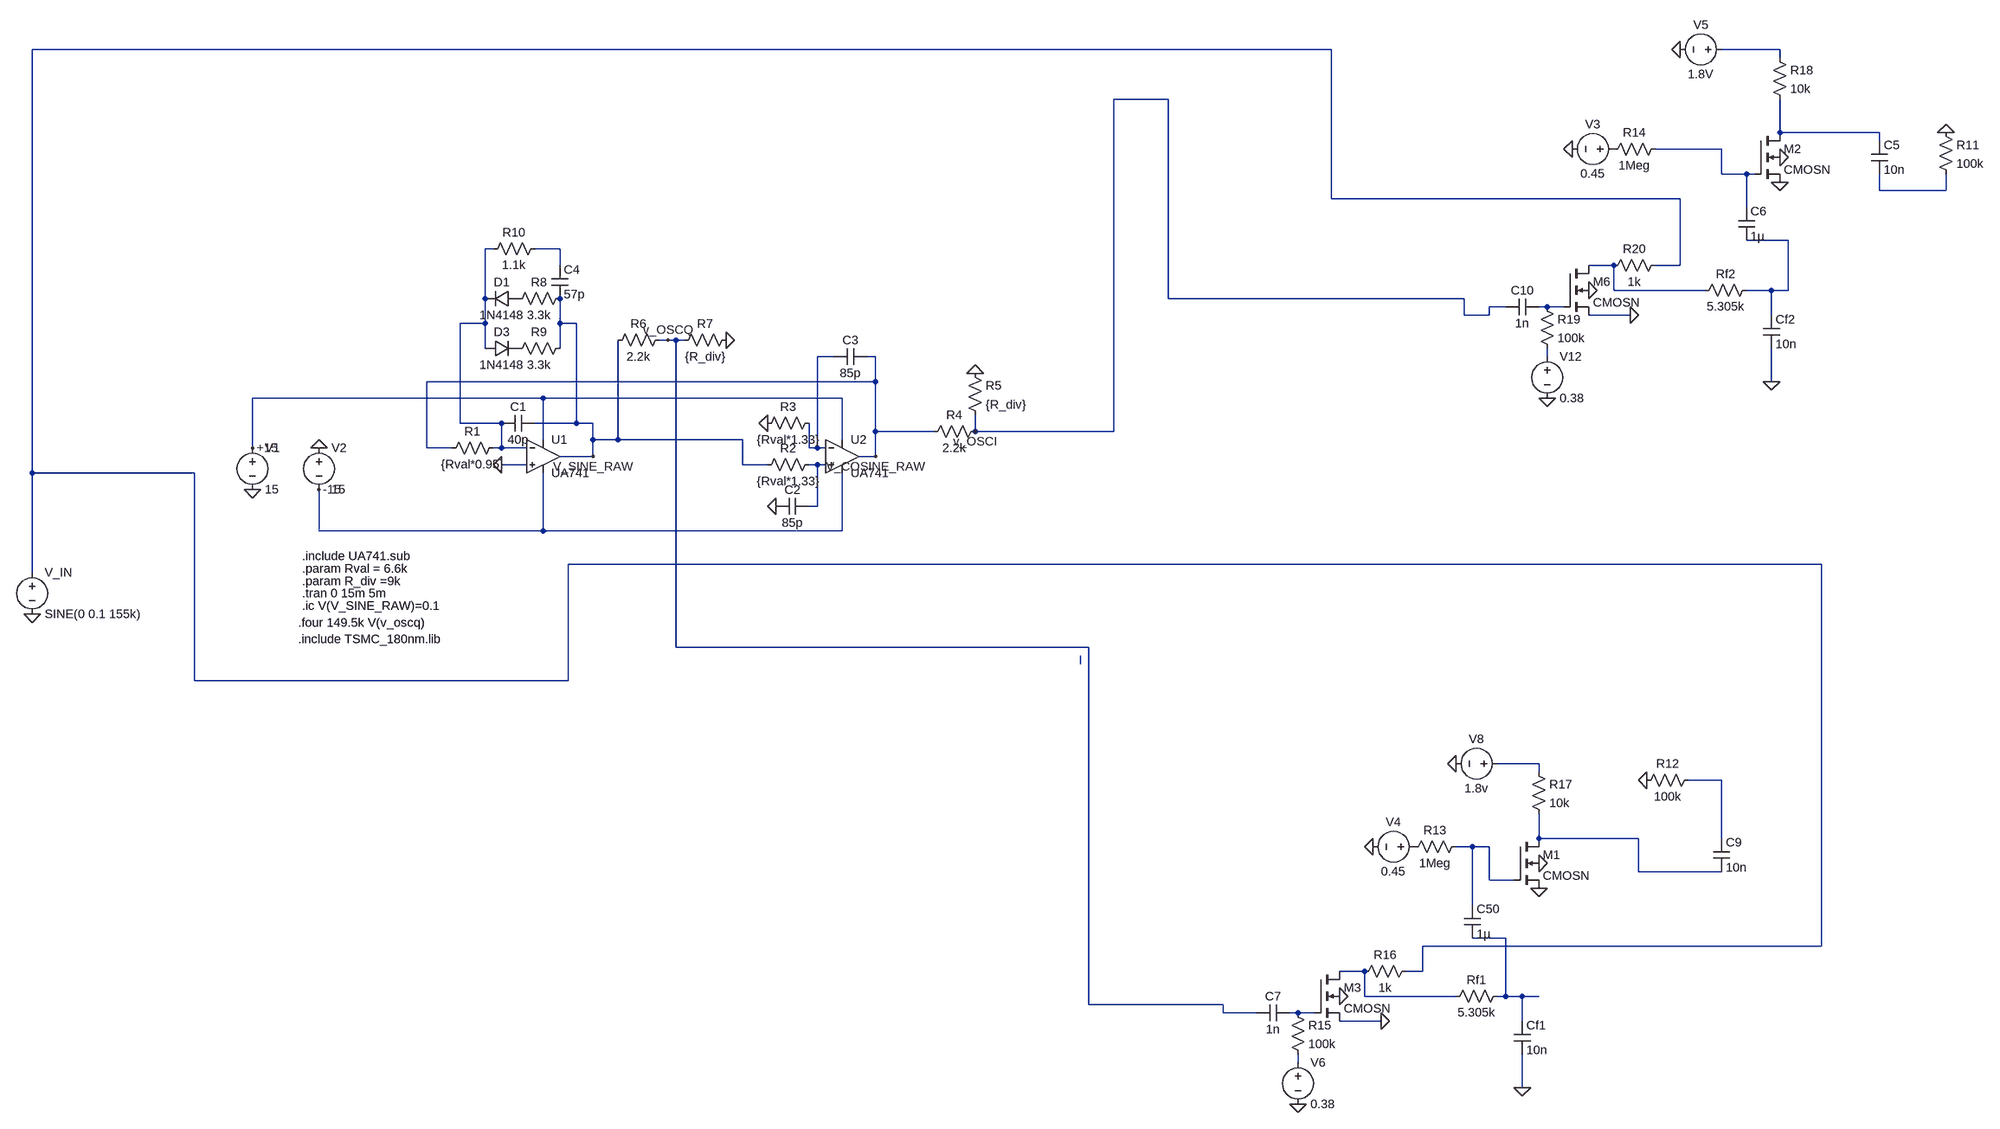
[diagram p0: schematic Final_CKT.asc]
Final_CKT.asc, the LTspice schematic file:
Version 4
SHEET 1 1700 2048
WIRE 288 -96 -2816 -96
WIRE 1152 -96 1040 -96
WIRE 1152 -80 1152 -96
WIRE -288 0 -656 0
WIRE 1152 64 1152 0
WIRE 1344 64 1152 64
WIRE 1344 80 1344 64
WIRE 1040 96 912 96
WIRE 1040 144 1040 96
WIRE 1088 144 1040 144
WIRE 1104 144 1088 144
WIRE 1344 176 1344 144
WIRE 1472 176 1472 144
WIRE 1472 176 1344 176
WIRE 288 192 288 -96
WIRE 960 192 288 192
WIRE 1088 208 1088 144
WIRE 1168 272 1088 272
WIRE -1856 288 -1872 288
WIRE -1728 288 -1776 288
WIRE -1728 320 -1728 288
WIRE 832 320 784 320
WIRE 960 320 960 192
WIRE 960 320 912 320
WIRE 832 368 832 320
WIRE 1008 368 832 368
WIRE 1136 368 1088 368
WIRE 1168 368 1168 272
WIRE 1168 368 1136 368
WIRE -1872 384 -1872 288
WIRE -288 384 -288 0
WIRE 544 384 -288 384
WIRE 624 400 592 400
WIRE 704 400 688 400
WIRE 736 400 704 400
WIRE 544 416 544 384
WIRE 592 416 592 400
WIRE 592 416 544 416
WIRE 864 416 784 416
WIRE 1136 416 1136 368
WIRE -1872 432 -1872 384
WIRE -1872 432 -1920 432
WIRE -1728 432 -1728 384
WIRE -1696 432 -1728 432
WIRE -1520 464 -1536 464
WIRE -1504 464 -1520 464
WIRE -1488 464 -1504 464
WIRE -1872 480 -1872 432
WIRE -1728 480 -1728 432
WIRE -1200 496 -1232 496
WIRE -1120 496 -1136 496
WIRE 704 496 704 480
WIRE -1120 544 -1120 496
WIRE -1120 544 -1984 544
WIRE 1136 544 1136 480
WIRE -1760 576 -2320 576
WIRE -1184 576 -1760 576
WIRE -1920 624 -1920 432
WIRE -1840 624 -1920 624
WIRE -1696 624 -1696 432
WIRE -1696 624 -1776 624
WIRE -1664 624 -1696 624
WIRE -1120 640 -1120 544
WIRE -1008 640 -1120 640
WIRE -928 640 -928 608
WIRE -656 640 -656 0
WIRE -656 640 -928 640
WIRE -1760 656 -1760 576
WIRE -1664 656 -1664 624
WIRE -1616 656 -1616 464
WIRE -1616 656 -1664 656
WIRE -1376 656 -1616 656
WIRE -1184 656 -1184 576
WIRE -2320 672 -2320 576
WIRE -1984 672 -1984 544
WIRE -1936 672 -1984 672
WIRE -1840 672 -1840 624
WIRE -1840 672 -1856 672
WIRE -1792 672 -1840 672
WIRE -1248 672 -1248 624
WIRE -1232 672 -1232 496
WIRE -1232 672 -1248 672
WIRE -1216 672 -1232 672
WIRE -1664 688 -1664 656
WIRE -1664 688 -1728 688
WIRE -1120 688 -1120 640
WIRE -1120 688 -1152 688
WIRE -1792 704 -1840 704
WIRE -1376 704 -1376 656
WIRE -1328 704 -1376 704
WIRE -1232 704 -1248 704
WIRE -1216 704 -1232 704
WIRE -2816 720 -2816 -96
WIRE -2432 720 -2816 720
WIRE -1232 784 -1232 704
WIRE -1232 784 -1248 784
WIRE -2192 832 -2192 752
WIRE -1760 832 -1760 720
WIRE -1760 832 -2192 832
WIRE -1184 832 -1184 720
WIRE -1184 832 -1760 832
WIRE 1232 896 -1712 896
WIRE -2816 912 -2816 720
WIRE -1504 1056 -1504 464
WIRE -704 1056 -1504 1056
WIRE -720 1088 -720 1072
WIRE -2432 1120 -2432 720
WIRE -1712 1120 -1712 896
WIRE -1712 1120 -2432 1120
WIRE 688 1280 608 1280
WIRE 688 1296 688 1280
WIRE 1040 1312 976 1312
WIRE 688 1424 688 1376
WIRE 880 1424 688 1424
WIRE 1040 1424 1040 1312
WIRE 560 1440 528 1440
WIRE 592 1440 560 1440
WIRE 880 1488 880 1424
WIRE 1040 1488 880 1488
WIRE 592 1504 592 1440
WIRE 640 1504 592 1504
WIRE 560 1552 560 1440
WIRE 624 1616 560 1616
WIRE 1232 1632 1232 896
WIRE 1232 1632 464 1632
WIRE 352 1680 304 1680
WIRE 464 1680 464 1632
WIRE 464 1680 432 1680
WIRE 352 1728 352 1680
WIRE 528 1728 352 1728
WIRE 624 1728 624 1616
WIRE 624 1728 608 1728
WIRE 656 1728 624 1728
WIRE 688 1728 656 1728
WIRE -704 1744 -704 1056
WIRE 80 1744 -704 1744
WIRE 80 1760 80 1744
WIRE 144 1760 80 1760
WIRE 224 1760 208 1760
WIRE 256 1760 224 1760
WIRE 384 1776 304 1776
WIRE 656 1776 656 1728
WIRE 224 1856 224 1840
WIRE 656 1904 656 1840
FLAG -2320 752 0
FLAG -2192 672 0
FLAG -2320 672 +15
FLAG -2192 752 -15
FLAG -1840 704 0
FLAG -1664 688 V_SINE_RAW
FLAG -1312 784 0
FLAG -1328 624 0
FLAG -1120 688 V_COSINE_RAW
FLAG -928 528 0
FLAG -928 640 v_OSCI
FLAG -1408 464 0
FLAG -1520 464 v_OSCQ
FLAG -2816 992 0
FLAG 224 1936 0
FLAG 304 1728 0
FLAG 656 1904 0
FLAG 704 576 0
FLAG 784 368 0
FLAG 1136 544 0
FLAG 1472 64 0
FLAG 896 1312 0
FLAG 960 -96 0
FLAG 752 96 0
FLAG 528 1280 0
FLAG 368 1440 0
FLAG 1152 112 0
FLAG 1152 160 0
FLAG 688 1520 0
FLAG 688 1472 0
FLAG 384 1776 0
FLAG 864 416 0
SYMBOL voltage -2320 656 R0
WINDOW 123 0 0 Left 0
WINDOW 39 0 0 Left 0
SYMATTR InstName V1
SYMATTR Value 15
SYMBOL voltage -2192 656 R0
WINDOW 123 0 0 Left 0
WINDOW 39 0 0 Left 0
SYMATTR InstName V2
SYMATTR Value 15
SYMBOL opamp2 -1760 624 R0
SYMATTR InstName U1
SYMATTR Value UA741
SYMBOL opamp2 -1184 624 R0
SYMATTR InstName U2
SYMATTR Value UA741
SYMBOL res -1840 656 R90
WINDOW 0 0 56 VBottom 2
WINDOW 3 32 56 VTop 2
SYMATTR InstName R1
SYMATTR Value {Rval*0.95}
SYMBOL cap -1776 608 R90
WINDOW 0 0 32 VBottom 2
WINDOW 3 32 32 VTop 2
SYMATTR InstName C1
SYMATTR Value 40p
SYMBOL res -1232 688 R90
WINDOW 0 0 56 VBottom 2
WINDOW 3 32 56 VTop 2
SYMATTR InstName R2
SYMATTR Value {Rval*1.33}
SYMBOL cap -1248 768 R90
WINDOW 0 0 32 VBottom 2
WINDOW 3 32 32 VTop 2
SYMATTR InstName C2
SYMATTR Value 85p
SYMBOL res -1232 608 R90
WINDOW 0 0 56 VBottom 2
WINDOW 3 32 56 VTop 2
SYMATTR InstName R3
SYMATTR Value {Rval*1.33}
SYMBOL cap -1136 480 R90
WINDOW 0 0 32 VBottom 2
WINDOW 3 32 32 VTop 2
SYMATTR InstName C3
SYMATTR Value 85p
SYMBOL res -912 624 R90
WINDOW 0 0 56 VBottom 2
WINDOW 3 32 56 VTop 2
SYMATTR InstName R4
SYMATTR Value 2.2k
SYMBOL res -944 512 R0
SYMATTR InstName R5
SYMATTR Value {R_div}
SYMBOL res -1520 448 R90
WINDOW 0 0 56 VBottom 2
WINDOW 3 32 56 VTop 2
SYMATTR InstName R6
SYMATTR Value 2.2k
SYMBOL res -1392 448 R90
WINDOW 0 0 56 VBottom 2
WINDOW 3 32 56 VTop 2
SYMATTR InstName R7
SYMATTR Value {R_div}
SYMBOL diode -1808 368 R90
WINDOW 0 0 32 VBottom 2
WINDOW 3 32 32 VTop 2
SYMATTR InstName D1
SYMATTR Value 1N4148
SYMBOL diode -1872 496 R270
WINDOW 0 32 32 VTop 2
WINDOW 3 0 32 VBottom 2
SYMATTR InstName D3
SYMATTR Value 1N4148
SYMBOL res -1712 368 R90
WINDOW 0 0 56 VBottom 2
WINDOW 3 32 56 VTop 2
SYMATTR InstName R8
SYMATTR Value 3.3k
SYMBOL res -1712 464 R90
WINDOW 0 0 56 VBottom 2
WINDOW 3 32 56 VTop 2
SYMATTR InstName R9
SYMATTR Value 3.3k
SYMBOL res -1760 272 R90
WINDOW 0 0 56 VBottom 2
WINDOW 3 32 56 VTop 2
SYMATTR InstName R10
SYMATTR Value 1.1k
SYMBOL cap -1744 320 R0
SYMATTR InstName C4
SYMATTR Value 57p
SYMBOL Voltage -2816 896 R0
SYMATTR InstName V_IN
SYMATTR Value SINE(0 0.1 155k)
SYMBOL nmos4 256 1680 R0
SYMATTR InstName M3
SYMATTR Value CMOSN
SYMATTR Value2 l=0.18u w=10u ad=5p as=5p pd=21u ps=21u
SYMBOL cap 208 1744 R90
WINDOW 0 0 32 VBottom 2
WINDOW 3 32 32 VTop 2
SYMATTR InstName C7
SYMATTR Value 1n
SYMBOL res 208 1744 R0
SYMATTR InstName R15
SYMATTR Value 100k
SYMBOL res 448 1664 R90
WINDOW 0 0 56 VBottom 2
WINDOW 3 32 56 VTop 2
SYMATTR InstName R16
SYMATTR Value 1k
SYMBOL voltage 224 1840 R0
WINDOW 123 0 0 Left 0
WINDOW 39 0 0 Left 0
SYMATTR InstName V6
SYMATTR Value 0.38
SYMBOL Res 624 1712 R90
WINDOW 0 0 56 VBottom 2
WINDOW 3 32 56 VTop 2
SYMATTR InstName Rf1
SYMATTR Value 5.305k
SYMBOL Cap 640 1776 R0
SYMATTR InstName Cf1
SYMATTR Value 10n
SYMBOL nmos4 736 320 R0
SYMATTR InstName M6
SYMATTR Value CMOSN
SYMATTR Value2 l=0.18u w=10u ad=5p as=5p pd=21u ps=21u
SYMBOL cap 688 384 R90
WINDOW 0 0 32 VBottom 2
WINDOW 3 32 32 VTop 2
SYMATTR InstName C10
SYMATTR Value 1n
SYMBOL res 688 384 R0
SYMATTR InstName R19
SYMATTR Value 100k
SYMBOL res 928 304 R90
WINDOW 0 0 56 VBottom 2
WINDOW 3 32 56 VTop 2
SYMATTR InstName R20
SYMATTR Value 1k
SYMBOL voltage 704 480 R0
WINDOW 123 0 0 Left 0
WINDOW 39 0 0 Left 0
SYMATTR InstName V12
SYMATTR Value 0.38
SYMBOL Res 1104 352 R90
WINDOW 0 0 56 VBottom 2
WINDOW 3 32 56 VTop 2
SYMATTR InstName Rf2
SYMATTR Value 5.305k
SYMBOL Cap 1120 416 R0
SYMATTR InstName Cf2
SYMATTR Value 10n
SYMBOL nmos4 640 1424 R0
SYMATTR InstName M1
SYMATTR Value CMOSN
SYMATTR Value2 l=0.35u w=210u
SYMBOL nmos4 1104 64 R0
SYMATTR InstName M2
SYMATTR Value CMOSN
SYMATTR Value2 l=0.35u w=210u
SYMBOL voltage 848 96 R90
WINDOW 0 -32 56 VBottom 2
WINDOW 3 32 56 VTop 2
WINDOW 123 0 0 Left 0
WINDOW 39 0 0 Left 0
SYMATTR InstName V3
SYMATTR Value 0.45
SYMBOL voltage 464 1440 R90
WINDOW 0 -32 56 VBottom 2
WINDOW 3 32 56 VTop 2
WINDOW 123 0 0 Left 0
WINDOW 39 0 0 Left 0
SYMATTR InstName V4
SYMATTR Value 0.45
SYMBOL cap 1328 80 R0
SYMATTR InstName C5
SYMATTR Value 10n
SYMBOL cap 1072 208 R0
SYMATTR InstName C6
SYMATTR Value 1µ
SYMBOL cap 544 1552 R0
SYMATTR InstName C50
SYMATTR Value 1µ
SYMBOL cap 1024 1424 R0
SYMATTR InstName C9
SYMATTR Value 10n
SYMBOL res 1456 48 R0
SYMATTR InstName R11
SYMATTR Value 100k
SYMBOL res 992 1296 R90
WINDOW 0 0 56 VBottom 2
WINDOW 3 32 56 VTop 2
SYMATTR InstName R12
SYMATTR Value 100k
SYMBOL res 544 1424 R90
WINDOW 0 0 56 VBottom 2
WINDOW 3 32 56 VTop 2
SYMATTR InstName R13
SYMATTR Value 1Meg
SYMBOL res 928 80 R90
WINDOW 0 0 56 VBottom 2
WINDOW 3 32 56 VTop 2
SYMATTR InstName R14
SYMATTR Value 1Meg
SYMBOL res 672 1280 R0
SYMATTR InstName R17
SYMATTR Value 10k
SYMBOL res 1136 -96 R0
SYMATTR InstName R18
SYMATTR Value 10k
SYMBOL voltage 1056 -96 R90
WINDOW 0 -32 56 VBottom 2
WINDOW 3 32 56 VTop 2
SYMATTR InstName V5
SYMATTR Value 1.8V
SYMBOL voltage 624 1280 R90
WINDOW 0 -32 56 VBottom 2
WINDOW 3 32 56 VTop 2
WINDOW 123 0 0 Left 0
WINDOW 39 0 0 Left 0
SYMATTR InstName V8
SYMATTR Value 1.8v
TEXT -2224 880 Left 2 !.include UA741.sub
TEXT -2224 904 Left 2 !.param Rval = 6.6k
TEXT -2224 928 Left 2 !.param R_div =9k
TEXT -2224 952 Left 2 !.tran 0 15m 5m
TEXT -2224 976 Left 2 !.ic V(V_SINE_RAW)=0.1
TEXT -2232 1008 Left 2 !.four 149.5k V(v_oscq)
TEXT -2232 1040 Left 2 !.include TSMC_180nm.lib

The netlist it stands for:
* Final_CKT.asc
V1 +15 0 15
V2 0 -15 15
XU1 0 N007 +15 -15 V_SINE_RAW UA741  ; pins In+ In- V+ V- OUT
XU2 N013 N011 +15 -15 V_COSINE_RAW UA741  ; pins In+ In- V+ V- OUT
R1 N007 V_COSINE_RAW {Rval*0.95}
C1 V_SINE_RAW N007 40p
R2 N013 V_SINE_RAW {Rval*1.33}
C2 N013 0 85p
R3 N011 0 {Rval*1.33}
C3 V_COSINE_RAW N011 85p
R4 v_OSCI V_COSINE_RAW 2.2k
R5 0 v_OSCI {R_div}
R6 v_OSCQ V_SINE_RAW 2.2k
R7 0 v_OSCQ {R_div}
D1 P001 N007 1N4148
D3 N007 P002 1N4148
R8 V_SINE_RAW P001 3.3k
R9 V_SINE_RAW P002 3.3k
R10 N008 N007 1.1k
C4 N008 V_SINE_RAW 57p
V_IN N001 0 SINE(0 0.1 155k)
M3 N020 N021 0 0 CMOSN l=0.18u w=10u ad=5p as=5p pd=21u ps=21u
C7 N021 v_OSCQ 1n
R15 N021 N022 100k
R16 N001 N020 1k
V6 N022 0 0.38
Rf1 N019 N020 5.305k
Cf1 N019 0 10n
M6 N009 N010 0 0 CMOSN l=0.18u w=10u ad=5p as=5p pd=21u ps=21u
C10 N010 v_OSCI 1n
R19 N010 N012 100k
R20 N001 N009 1k
V12 N012 0 0.38
Rf2 N006 N009 5.305k
Cf2 N006 0 10n
M1 N017 N018 0 0 CMOSN l=0.35u w=210u
M2 N003 N004 0 0 CMOSN l=0.35u w=210u
V3 P003 0 0.45
V4 P004 0 0.45
C5 N003 N005 10n
C6 N004 N006 1µ
C50 N018 N019 1µ
C9 N016 N017 10n
R11 0 N005 100k
R12 N016 0 100k
R13 N018 P004 1Meg
R14 N004 P003 1Meg
R17 N015 N017 10k
R18 N002 N003 10k
V5 N002 0 1.8V
V8 N015 0 1.8v
.model D D
.lib standard.dio
.model NMOS NMOS
.model PMOS PMOS
.lib standard.mos
.include UA741.sub
.param Rval = 6.6k
.param R_div =9k
.tran 0 15m 5m
.ic V(V_SINE_RAW)=0.1
.four 149.5k V(v_oscq)
.include TSMC_180nm.lib
.backanno
.end